# Altium schematic sheet MY_DEMO_12864.SchDoc
size A3
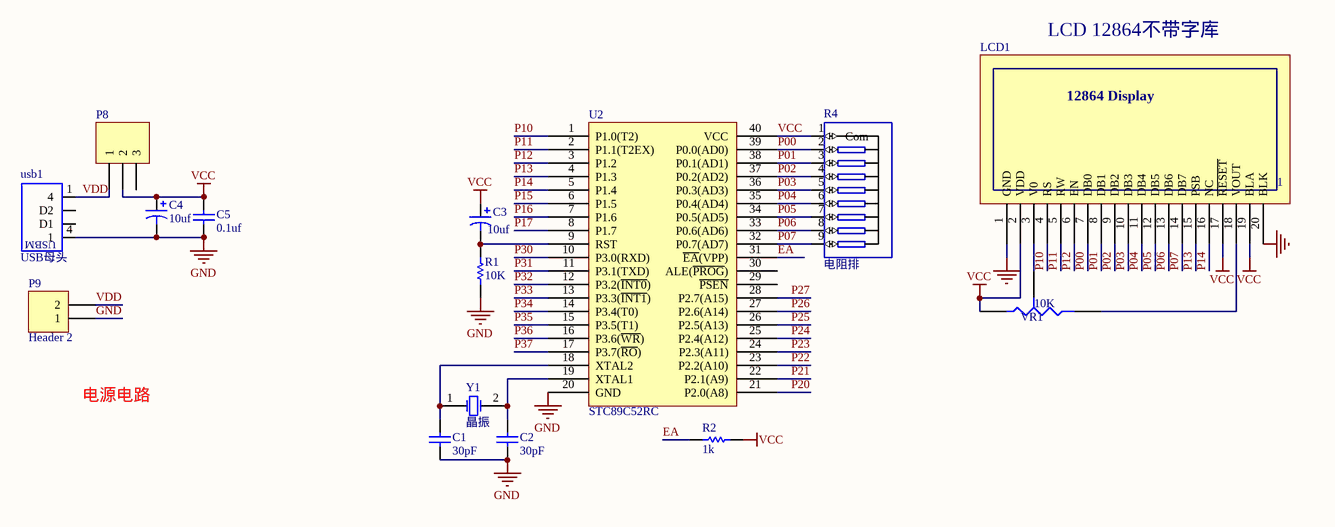
[diagram p0: MY_DEMO_12864.SchDoc]

## Parts
C1  value 30pF  [RAD-0.1]  (hidden comment: 瓷片电容)
C2  value 30pF  [RAD-0.1]  (hidden comment: 瓷片电容)
C3  value 10uf  [10UF]  (hidden comment: 电解电容)
C4  value 10uf  [10UF]  (hidden comment: 点解电容)
C5  value 0.1uf  [CB1]  (hidden comment: 瓷片电容)
LCD1  1  [12864]
P8  Header 3  [HDR1X3]  (value not drawn)
P9  Header 2  [HDR1X2]
R1  value 10K  [电阻0.7-1.6]  (hidden comment: 电阻)
R2  value 1k  [电阻0.7-1.6]  (hidden comment: 电阻)
R4  电阻排  [插槽P9]
U2  STC89C52RC  [DIP-40W]
usb1  USB母头  [A母USB]
VR1  12864  [RW]  (value not drawn)
Y1  晶振  [XTAL]

## Nets
GND: C1.1 C2.1 C4.2 C5.1 LCD1.1(GND) LCD1.20(BLK) P9.1 R1.1 U2.20(GND) usb1.4(1)
VCC: C3.1 C4.1 C5.2 LCD1.2(VDD) LCD1.17(~{RESET}) LCD1.19(BLA) P8.2 R2.1 R4.1(Com) U2.40(VCC) VR1.1
EA: R2.2 U2.31(~{EA}(VPP))
P00: LCD1.7(DB0) R4.2 U2.39(P0.0(AD0))
P01: LCD1.8(DB1) R4.3 U2.38(P0.1(AD1))
P02: LCD1.9(DB2) R4.4 U2.37(P0.2(AD2))
P03: LCD1.10(DB3) R4.5 U2.36(P0.3(AD3))
P04: LCD1.11(DB4) R4.6 U2.35(P0.4(AD4))
P05: LCD1.12(DB5) R4.7 U2.34(P0.5(AD5))
P06: LCD1.13(DB6) R4.8 U2.33(P0.6(AD6))
P07: LCD1.14(DB7) R4.9 U2.32(P0.7(AD7))
P10: LCD1.4(RS) U2.1(P1.0(T2))
P11: LCD1.5(RW) U2.2(P1.1(T2EX))
P12: LCD1.6(EN) U2.3(P1.2)
P13: LCD1.15(PSB) U2.4(P1.3)
P14: LCD1.16(NC) U2.5(P1.4)
P15: U2.6(P1.5)
P16: U2.7(P1.6)
P17: U2.8(P1.7)
P20: U2.21(P2.0(A8))
P21: U2.22(P2.1(A9))
P22: U2.23(P2.2(A10))
P23: U2.24(P2.3(A11))
P24: U2.25(P2.4(A12))
P25: U2.26(P2.5(A13))
P26: U2.27(P2.6(A14))
P27: U2.28(P2.7(A15))
P30: U2.10(P3.0(RXD))
P31: U2.11(P3.1(TXD))
P32: U2.12(P3.2(~{INT0}))
P33: U2.13(P3.3(~{INT1}))
P34: U2.14(P3.4(T0))
P35: U2.15(P3.5(T1))
P36: U2.16(P3.6(~{WR}))
P37: U2.17(P3.7(~{RO}))
VDD: P8.1 P9.2 usb1.1(4)
NetC1_2: C1.2 U2.18(XTAL2) Y1.1(OSC1)
NetC2_2: C2.2 U2.19(XTAL1) Y1.2(OSC2)
NetC3_2: C3.2 R1.2 U2.9(RST)
NetLCD1_3: LCD1.3(V0) VR1.2
NetLCD1_18: LCD1.18(VOUT) VR1.3

Not connected (* = marked no-connect by the designer): P8 3; U2 29(~{PSEN}) 30(ALE(~{PROG})); usb1 D1 D2

## Notes on the sheet
- 电源电路
- Labels drawn without touching a wire or pin: LCD 12864不带字库
- (in symbol LCD12864-CK) 12864 Display
- (in symbol RES-TAP) 10K
- (in symbol USB) USBM

## Library data of the parts
C1 C2 C5 = Cap: Capacitor; Published: 8-Jun-2000; LatestRevisionDate: 17-Jul-2002; LatestRevisionNote: Re-released for DXP Platform.; PackageReference: RAD-0.3; Publisher: Altium Limited; PackageDescription: Radial Cap, Thru-Hole; 2 Leads; 0.3 in Pin Spacing
C3 C4 = Cap Pol1: Polarized Capacitor (Radial); Published: 8-Jun-2000; LatestRevisionDate: 17-Jul-2002; LatestRevisionNote: Re-released for DXP Platform.; PackageReference: RB7.6-15; Publisher: Altium Limited; PackageDescription: Polarized Capacitor (Radial); 2 Leads
LCD1 = LCD12864-CK
P8 = Header 3: Header, 3-Pin; LatestRevisionDate: 17-Jul-2002; LatestRevisionNote: Re-released for DXP Platform.; Publisher: Altium Limited
P9 = Header 2: Header, 2-Pin; LatestRevisionDate: 17-Jul-2002; LatestRevisionNote: Re-released for DXP Platform.; Publisher: Altium Limited
R1 R2 = Res1: Resistor; Published: 8-Jun-2000; LatestRevisionDate: 17-Jul-2002; LatestRevisionNote: Re-released for DXP Platform.; PackageReference: AXIAL-0.3; Publisher: Altium Limited; PackageDescription: Axial Device, Thru-Hole; 2 Leads; 0.3 in Pin Spacing
R4 = RES10
U2 = 89C52
usb1 = USB
VR1 = RES-TAP
Y1 = XTAL: Crystal Oscillator; Published: 8-Jun-2000; LatestRevisionDate: 17-Jul-2002; LatestRevisionNote: Re-released for DXP Platform.; PackageReference: R38; Publisher: Altium Limited; PackageDescription: Crystal, Thru-Hole; 2 Leads; Body 3.1 x 8.2 mm (Dia.xH)